# Altium schematic sheet COM-TopLevel.SchDoc: Top Level
size B; CompanyName: Lockheed Martin; Organization: Colorado Space Grant; DocumentNumber: 1; SheetNumber: 1; SheetTotal: 7; ProjectName: COM_Digital.prjpcb
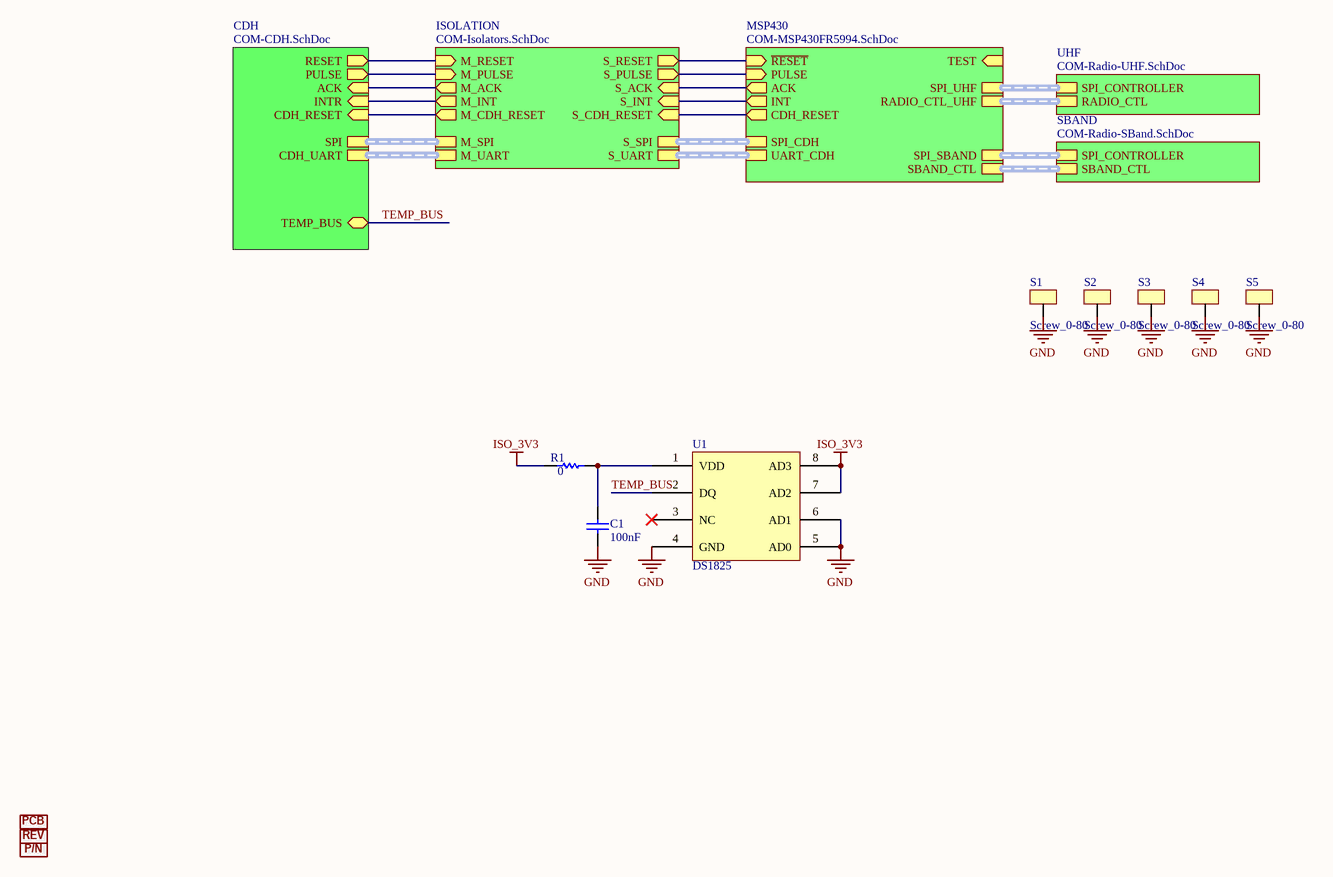
[diagram p0: COM-TopLevel.SchDoc]

## Parts
C1  Capacitance: 100nF  [1608[0603]]  (hidden comment: C0603C104J3RACAUTO)
INFO1  Info_Board  [Info_Board]  (value not drawn)  (no BOM)
INFO2  Info_Revision  [Info_Revision]  (value not drawn)  (no BOM)
INFO3  Info_PartNumber  [Info_PartNumber]  (value not drawn)  (no BOM)
R1  Resistance: 0  [1608[0603]]  (hidden comment: CRCW06030000Z0EAC)
S1  Screw_0-80  [Screw_0-80]
S2  Screw_0-80  [Screw_0-80]
S3  Screw_0-80  [Screw_0-80]
S4  Screw_0-80  [Screw_0-80]
S5  Screw_0-80  [Screw_0-80]
U1  DS1825  [DS1825]

## Sub-sheets
CDH = COM-CDH.SchDoc: SPI (harness SPI), ACK (in), PULSE (out), CDH_RESET (in), RESET (out), INTR (in), TEMP_BUS (bidir), CDH_UART (harness UART)
ISOLATION = COM-Isolators.SchDoc: M_PULSE (in), M_ACK (out), S_ACK (in), S_PULSE (out), M_SPI (harness SPI_CDH), S_SPI (harness SPI_CDH), M_RESET (in), M_INT (out), S_RESET (out), S_INT (in), M_CDH_RESET (out), S_CDH_RESET (in), M_UART (harness UART), S_UART (harness UART)
MSP430 = COM-MSP430FR5994.SchDoc: UART_CDH (harness UART), SPI_CDH (harness SPI), ACK (out), PULSE (in), INT (out), CDH_RESET (out), SPI_UHF (harness SPI), SPI_SBAND (harness SPI), ~{RESET} (in), TEST (in), RADIO_CTL_UHF (harness UHF_CTL), SBAND_CTL (harness SBAND_CTL)
SBAND = COM-Radio-SBand.SchDoc: SPI_CONTROLLER (harness SPI), SBAND_CTL (harness SBAND_CTL)
UHF = COM-Radio-UHF.SchDoc: SPI_CONTROLLER (harness SPI), RADIO_CTL (harness UHF_CTL)

## Nets
GND: C1.2 S1.1 S2.1 S3.1 S4.1 S5.1 U1.4(GND) U1.5(AD0) U1.6(AD1)
ISO_3V3: R1.1 U1.7(AD2) U1.8(AD3)
TEMP_BUS: U1.2(DQ) ; sheet CDH/TEMP_BUS
NetC1_1: C1.1 R1.2 U1.1(VDD)
(unnamed): sheet CDH/ACK, sheet ISOLATION/M_ACK
(unnamed): sheet CDH/PULSE, sheet ISOLATION/M_PULSE
(unnamed): sheet CDH/CDH_RESET, sheet ISOLATION/M_CDH_RESET
(unnamed): sheet CDH/RESET, sheet ISOLATION/M_RESET
(unnamed): sheet CDH/INTR, sheet ISOLATION/M_INT
(unnamed): sheet ISOLATION/S_ACK, sheet MSP430/ACK
(unnamed): sheet ISOLATION/S_PULSE, sheet MSP430/PULSE
(unnamed): sheet ISOLATION/S_RESET, sheet MSP430/~{RESET}
(unnamed): sheet ISOLATION/S_INT, sheet MSP430/INT
(unnamed): sheet ISOLATION/S_CDH_RESET, sheet MSP430/CDH_RESET

Not connected (* = marked no-connect by the designer): U1 3(NC)*

## Buses and harness runs
harness sheet CDH/CDH_UART = sheet ISOLATION/M_UART
harness sheet CDH/SPI = sheet ISOLATION/M_SPI
harness sheet ISOLATION/S_SPI = sheet MSP430/SPI_CDH
harness sheet ISOLATION/S_UART = sheet MSP430/UART_CDH
harness sheet MSP430/RADIO_CTL_UHF = sheet UHF/RADIO_CTL
harness sheet MSP430/SBAND_CTL = sheet SBAND/SBAND_CTL
harness sheet MSP430/SPI_SBAND = sheet SBAND/SPI_CONTROLLER
harness sheet MSP430/SPI_UHF = sheet UHF/SPI_CONTROLLER

## Notes on the sheet
- Title
- Board
- Date
- Engineer
- Filename
- Sheet
- of
- REV
- (in symbol 27305) PCB
- (in symbol 27306) REV
- (in symbol 27307) P/N

## Library data of the parts
C1 = 4929: MLCC 1608(0603) X7R 100NF 10% 50; PartNumber: CGA2B3X7R1H104K050BB; Manufacturer: TDK; Voltage: 50V; ID: 4929; Category: Ceramic; Status: Unchecked; Tolerance: ±10%; Package: 0402 (1005 Metric); ComponentLink1Description: Datasheet; ComponentLink1URL: http://product.tdk.com/capacitor/mlcc/en/documents/mlcc_automotive_general_en.pdf
INFO1 = 27305: Board Name, Engineer, Date; PartNumber: Board-Info; Manufacturer: COSGC; ID: 27305; Category: Labels; Status: Unchecked; ComponentLink1Description: Datasheet
INFO2 = 27306: Version, Rev, Flight Qualified; PartNumber: Board-Version; Manufacturer: COSGC; ID: 27306; Category: Labels; Status: Unchecked; ComponentLink1Description: Datasheet
INFO3 = 27307: ALL-STAR Part Number; PartNumber: Board-PartNumber; Manufacturer: COSGC; ID: 27307; Category: Labels; Status: Unchecked; ComponentLink1Description: Datasheet
R1 = 3740: RES SMD 0 OHM JUMP 1/10W 0603; PartNumber: CRCW04020000Z0ED; Manufacturer: Vishay; ID: 3740; Power: 0.063W, 1/16W; Tolerance: Jumper; Category: General Purpose; Status: Unchecked; Package: 0402 (1005 Metric); ComponentLink1Description: Datasheet; ComponentLink1URL: http://www.vishay.com/doc?20035
U1 = 27162: IC THERMOMETER DIGITAL 8-USOP; PartNumber: DS1825U+; Manufacturer: Maxim; ID: 27162; Category: Sensors; Status: Unchecked; ComponentLink1Description: Datasheet; ComponentLink1URL: http://datasheets.maximintegrated.com/en/ds/DS1825.pdf